# Altium schematic sheet TOF360.SchDoc
size 482 x 241 mm; SheetNumber: 6; SheetTotal: 12
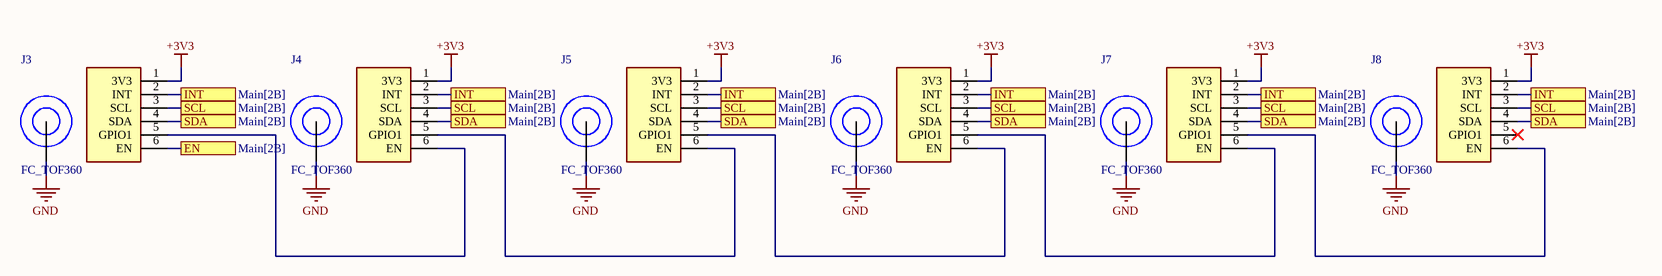
[diagram p0: TOF360.SchDoc]

## Parts
J3  FC_TOF360  [TOF_Mount]
J4  FC_TOF360  [TOF_Mount]
J5  FC_TOF360  [TOF_Mount]
J6  FC_TOF360  [TOF_Mount]
J7  FC_TOF360  [TOF_Mount]
J8  FC_TOF360  [TOF_Mount]

## Ports
EN (see Main[2B]), INT (see Main[2B]), SCL (see Main[2B]), SDA (see Main[2B])

## Nets
+3V3: J3.1(3V3) J4.1(3V3) J5.1(3V3) J6.1(3V3) J7.1(3V3) J8.1(3V3)
GND: J3.7 J4.7 J5.7 J6.7 J7.7 J8.7
EN: J3.6(EN) ; port EN
INT: J3.2(INT) J4.2(INT) J5.2(INT) J6.2(INT) J7.2(INT) J8.2(INT) ; port INT
SCL: J3.3(SCL) J4.3(SCL) J5.3(SCL) J6.3(SCL) J7.3(SCL) J8.3(SCL) ; port SCL
SDA: J3.4(SDA) J4.4(SDA) J5.4(SDA) J6.4(SDA) J7.4(SDA) J8.4(SDA) ; port SDA
NetJ3_5: J3.5(GPIO1) J4.6(EN)
NetJ4_5: J4.5(GPIO1) J5.6(EN)
NetJ5_5: J5.5(GPIO1) J6.6(EN)
NetJ6_5: J6.5(GPIO1) J7.6(EN)
NetJ7_5: J7.5(GPIO1) J8.6(EN)

Not connected (* = marked no-connect by the designer): J8 5(GPIO1)*